# Altium schematic sheet SchematicPULPiniMCU.SchDoc
size A4; DocumentNumber: 2; SheetNumber: 2; SheetTotal: 4
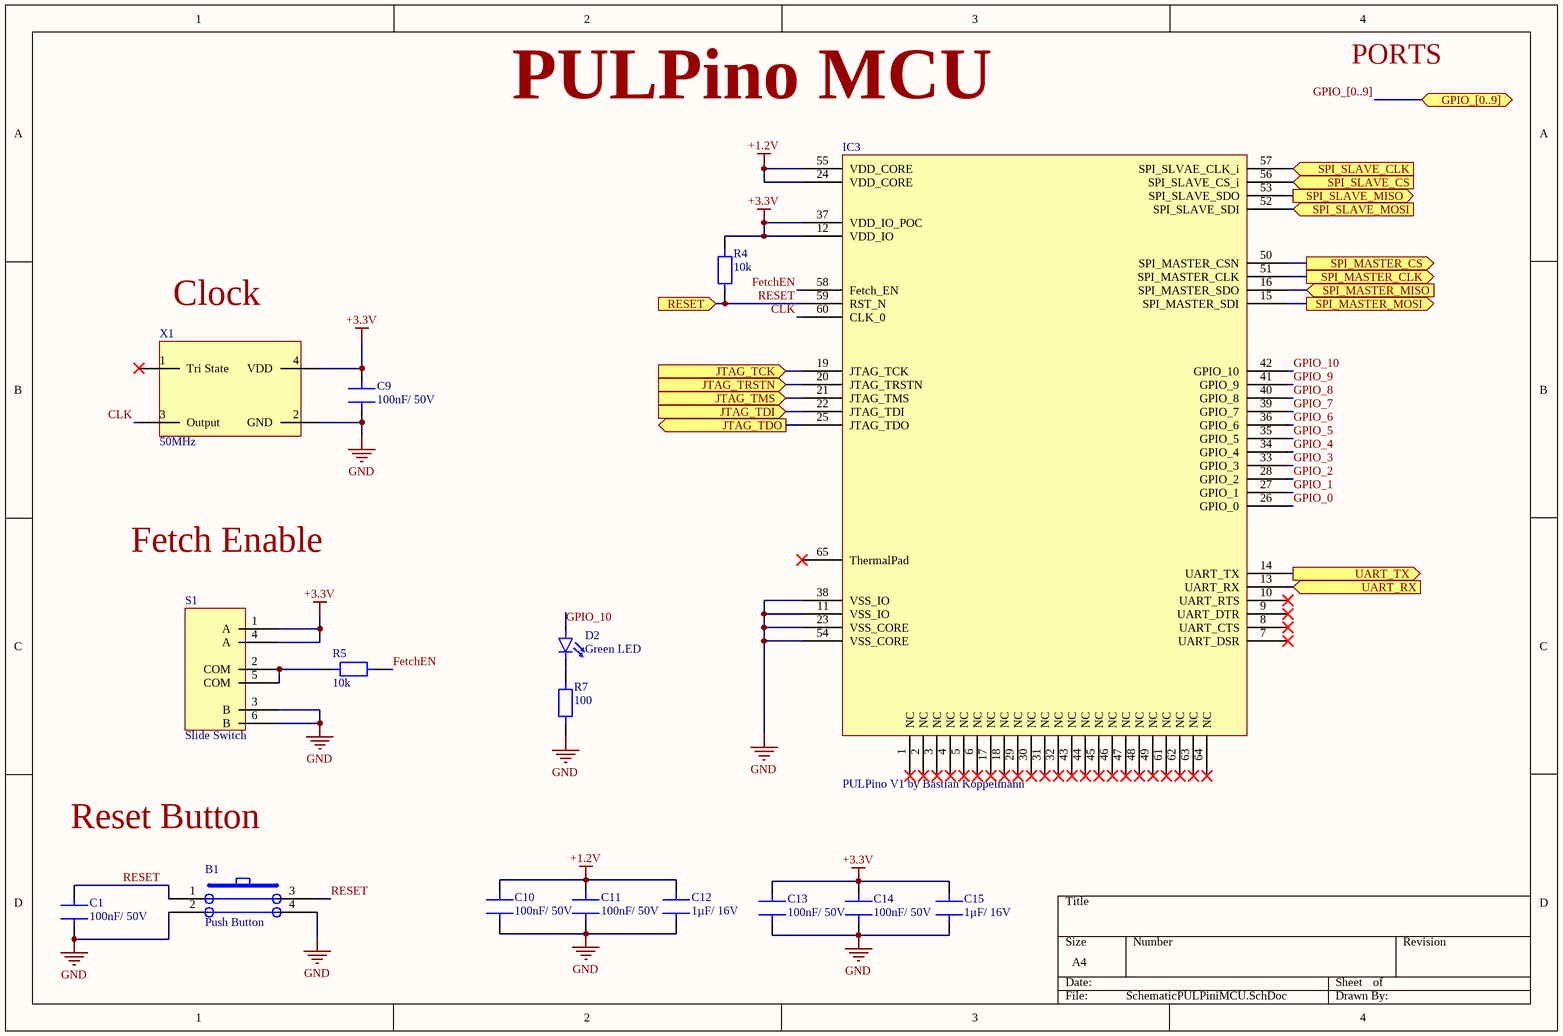
[diagram p0: SchematicPULPiniMCU.SchDoc]

## Parts
B1  Push Button  [PUSH Switch]
C1  100nF/ 50V  [C0603]
C9  100nF/ 50V  [C0603]
C10  100nF/ 50V  [C0603]
C11  100nF/ 50V  [C0603]
C12  1µF/ 16V  [C0603]
C13  100nF/ 50V  [C0603]
C14  100nF/ 50V  [C0603]
C15  1µF/ 16V  [C0603]
D2  Green LED  [LED_0805]
IC3  PULPino V1 by Bastian Koppelmann  [MQFN 64-Lead 9mm P=0.5mm]
R4  10k  [R0603]
R5  10k  [R0603]
R7  100  [R0603]
S1  Slide Switch  [Slide Switch WE 452403012014]
X1  50MHz  [QFN 2520 SiT1602 Oscillators 2.5x2.0mm]

## Ports
GPIO_[0..9] (bidir), JTAG_TCK (in), JTAG_TDI (in), JTAG_TDO (out), JTAG_TMS (in), JTAG_TRSTN (in), RESET (in), SPI_MASTER_CLK (out), SPI_MASTER_CS (out), SPI_MASTER_MISO (in), SPI_MASTER_MOSI (out), SPI_SLAVE_CLK (in), SPI_SLAVE_CS (in), SPI_SLAVE_MISO (out), SPI_SLAVE_MOSI (in), UART_RX (in), UART_TX (out)

## Nets
+1.2V: C10.2 C11.2 C12.2 IC3.24(VDD_CORE) IC3.55(VDD_CORE)
+3.3V: C9.1 C13.2 C14.2 C15.2 IC3.12(VDD_IO) IC3.37(VDD_IO_POC) R4.2 S1.1(A) S1.4(A) X1.4(VDD)
GND: B1.2 B1.4 C1.2 C9.2 C10.1 C11.1 C12.1 C13.1 C14.1 C15.1 IC3.11(VSS_IO) IC3.23(VSS_CORE) IC3.38(VSS_IO) IC3.54(VSS_CORE) R7.1 S1.3(B) S1.6(B) X1.2(GND)
CLK: IC3.60(CLK_0) X1.3(Output)
FetchEN: IC3.58(Fetch_EN) R5.2
GPIO_0: IC3.26(GPIO_0)
GPIO_1: IC3.27(GPIO_1)
GPIO_2: IC3.28(GPIO_2)
GPIO_3: IC3.33(GPIO_3)
GPIO_4: IC3.34(GPIO_4)
GPIO_5: IC3.35(GPIO_5)
GPIO_6: IC3.36(GPIO_6)
GPIO_7: IC3.39(GPIO_7)
GPIO_8: IC3.40(GPIO_8)
GPIO_9: IC3.41(GPIO_9)
GPIO_10: D2.1 IC3.42(GPIO_10)
JTAG_TCK: IC3.19(JTAG_TCK) ; port JTAG_TCK
JTAG_TDI: IC3.22(JTAG_TDI) ; port JTAG_TDI
JTAG_TDO: IC3.25(JTAG_TDO) ; port JTAG_TDO
JTAG_TMS: IC3.21(JTAG_TMS) ; port JTAG_TMS
JTAG_TRSTN: IC3.20(JTAG_TRSTN) ; port JTAG_TRSTN
RESET: B1.1 B1.3 C1.1 IC3.59(RST_N) R4.1 ; port RESET
SPI_MASTER_CLK: IC3.51(SPI_MASTER_CLK) ; port SPI_MASTER_CLK
SPI_MASTER_CS: IC3.50(SPI_MASTER_CSN) ; port SPI_MASTER_CS
SPI_MASTER_MISO: IC3.16(SPI_MASTER_SDO) ; port SPI_MASTER_MISO
SPI_MASTER_MOSI: IC3.15(SPI_MASTER_SDI) ; port SPI_MASTER_MOSI
SPI_SLAVE_CLK: IC3.57(SPI_SLVAE_CLK_i) ; port SPI_SLAVE_CLK
SPI_SLAVE_CS: IC3.56(SPI_SLAVE_CS_i) ; port SPI_SLAVE_CS
SPI_SLAVE_MISO: IC3.53(SPI_SLAVE_SDO) ; port SPI_SLAVE_MISO
SPI_SLAVE_MOSI: IC3.52(SPI_SLAVE_SDI) ; port SPI_SLAVE_MOSI
UART_RX: IC3.13(UART_RX) ; port UART_RX
UART_TX: IC3.14(UART_TX) ; port UART_TX
NetD2_2: D2.2 R7.2
NetR5_1: R5.1 S1.2(COM) S1.5(COM)

Not connected (* = marked no-connect by the designer): IC3 1(NC)* 2(NC)* 3(NC)* 4(NC)* 5(NC)* 6(NC)* 7(UART_DSR)* 8(UART_CTS)* 9(UART_DTR)* 10(UART_RTS)* 17(NC)* 18(NC)* 29(NC)* 30(NC)* 31(NC)* 32(NC)* 43(NC)* 44(NC)* 45(NC)* 46(NC)* 47(NC)* 48(NC)* 49(NC)* 61(NC)* 62(NC)* 63(NC)* 64(NC)* 65(ThermalPad)*; X1 1(Tri_State)*

## Buses and harness runs
bus GPIO_[0..9] = port GPIO_[0..9]

## Notes on the sheet
- (near IC3) PULPino MCU
- PORTS
- Clock
- Fetch Enable
- Reset Button

## Library data of the parts
B1 = Push Button PTS647SM50SMTR2LFS: PTS647SM50SMTR2LFS
C1 C9-C11 C13 C14 = C 100nF/ 50V: C0603/C0805
C12 C15 = C 1µF/ 16V: C0603/C0805
D2 = LED 0805: Status LED
IC3 = MCU PULPino V1 QFN64: Version 1 PULPino by Bastian Koppelmann
R4 R5 = RES_10k: 0805
R7 = RES_100: 0603/0805
S1 = Slide Switch WE 452403012014: Slide Switch, WE 452403012014
X1 = SiT1602BC-11-33N-50.000000: Oscillator 50MHz. Pin 1 NC